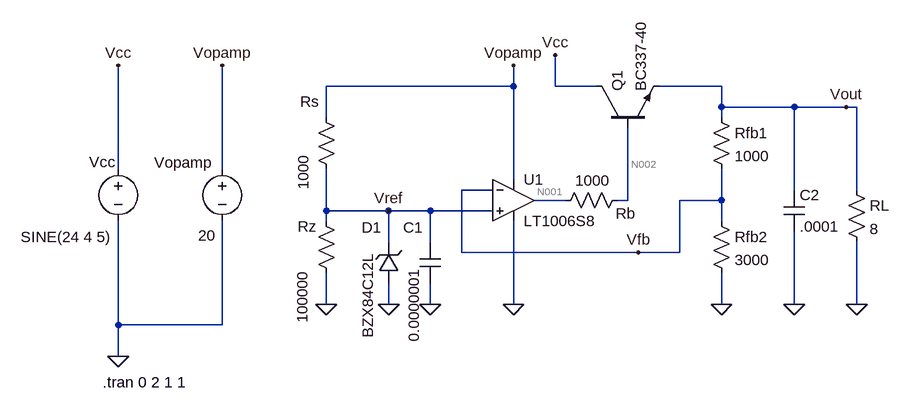
[diagram p0: schematic Op-Amp_linear_voltage_regulator (1).asc]
Op-Amp_linear_voltage_regulator (1).asc, the LTspice schematic file:
Version 4
SHEET 1 880 680
WIRE 224 -32 224 -64
WIRE 224 -32 -64 -32
WIRE 288 -32 288 -80
WIRE 352 -32 288 -32
WIRE 544 -32 448 -32
WIRE 544 0 544 -32
WIRE 656 0 544 0
WIRE 736 0 656 0
WIRE 752 0 736 0
WIRE -64 16 -64 -32
WIRE 544 16 544 0
WIRE -384 96 -384 -64
WIRE -224 96 -224 -64
WIRE 224 112 224 -32
WIRE 192 128 144 128
WIRE 656 128 656 0
WIRE 752 128 752 0
WIRE 304 144 256 144
WIRE 400 144 400 32
WIRE 400 144 384 144
WIRE 544 144 544 96
WIRE 544 144 480 144
WIRE -64 160 -64 96
WIRE 32 160 -64 160
WIRE 96 160 32 160
WIRE 192 160 96 160
WIRE -64 176 -64 160
WIRE 544 176 544 144
WIRE 32 208 32 160
WIRE 96 208 96 160
WIRE 144 224 144 128
WIRE 416 224 144 224
WIRE 480 224 480 144
WIRE 480 224 416 224
WIRE -64 304 -64 256
WIRE 32 304 32 272
WIRE 96 304 96 272
WIRE 224 304 224 176
WIRE 544 304 544 256
WIRE 656 304 656 192
WIRE 752 304 752 208
WIRE -384 336 -384 176
WIRE -224 336 -224 176
WIRE -224 336 -384 336
WIRE -384 384 -384 336
FLAG 288 -80 Vcc
FLAG 224 304 0
FLAG 32 304 0
FLAG 752 304 0
FLAG 544 304 0
FLAG -64 304 0
FLAG 736 0 Vout
FLAG 32 160 Vref
FLAG 96 304 0
FLAG 416 224 Vfb
FLAG -384 -64 Vcc
FLAG -384 384 0
FLAG -224 -64 Vopamp
FLAG 224 -64 Vopamp
FLAG 656 304 0
SYMBOL zener 48 272 R180
WINDOW 0 27 86 Left 2
WINDOW 3 48 47 VLeft 2
SYMATTR InstName D1
SYMATTR Value BZX84C12L
SYMBOL res -80 0 R0
WINDOW 0 -24 -8 Left 2
WINDOW 3 -19 127 VLeft 2
SYMATTR InstName Rs
SYMATTR Value 1000
SYMBOL res 528 160 R0
SYMATTR InstName Rfb2
SYMATTR Value 3000
SYMBOL res 528 0 R0
SYMATTR InstName Rfb1
SYMATTR Value 1000
SYMBOL res 736 112 R0
SYMATTR InstName RL
SYMATTR Value 8
SYMBOL res 400 128 R90
WINDOW 0 52 3 VBottom 2
WINDOW 3 -30 54 VTop 2
SYMATTR InstName Rb
SYMATTR Value 1000
SYMBOL res -80 160 R0
WINDOW 0 -28 24 Left 2
WINDOW 3 -21 173 VLeft 2
SYMATTR InstName Rz
SYMATTR Value 100000
SYMBOL cap 80 208 R0
WINDOW 0 -26 -22 Left 2
WINDOW 3 -9 154 VLeft 2
SYMATTR InstName C1
SYMATTR Value 0.0000001
SYMBOL voltage -384 80 R0
WINDOW 0 -45 5 Left 2
WINDOW 3 -150 120 Left 2
WINDOW 123 0 0 Left 2
WINDOW 39 0 0 Left 2
SYMATTR InstName Vcc
SYMATTR Value SINE(24 4 5)
SYMBOL Opamps\\LT1006S8 224 80 R0
SYMATTR InstName U1
SYMBOL voltage -224 80 R0
WINDOW 0 -105 6 Left 2
WINDOW 3 -37 118 Left 2
WINDOW 123 0 0 Left 2
WINDOW 39 0 0 Left 2
SYMATTR InstName Vopamp
SYMATTR Value 20
SYMBOL cap 640 128 R0
SYMATTR InstName C2
SYMATTR Value .0001
SYMBOL npn 352 32 R270
SYMATTR InstName Q1
SYMATTR Value BC337-40
TEXT -408 424 Left 2 !.tran 0 2 1 1

The netlist it stands for:
* Op-Amp_linear_voltage_regulator (1).asc
D1 0 Vref BZX84C12L
Rs Vopamp Vref 1000
Rfb2 Vfb 0 3000
Rfb1 Vout Vfb 1000
RL Vout 0 8
Rb N002 N001 1000
Rz Vref 0 100000
C1 Vref 0 0.0000001
Vcc Vcc 0 SINE(24 4 5)
XU1 Vref Vfb Vopamp 0 N001 LT1006S8  ; pins In+ In- V+ V- OUT
Vopamp Vopamp 0 20
C2 Vout 0 .0001
Q1 Vcc N002 Vout 0 BC337-40
.model D D
.lib standard.dio
.model NPN NPN
.model PNP PNP
.lib standard.bjt
.tran 0 2 1 1
.backanno
.end

* Results of the author's LTspice run, read from the files saved beside the schematic
* Operating Point, zero values left out:
*   V(vref) = 12.27 V
*   V(vopamp) = 20 V
*   V(vfb) = 7.966 V
*   V(vout) = 10.62 V
*   V(n002) = 11.7 V
*   V(n001) = 19.03 V
*   V(vcc) = 24 V
*   Ic(Q1) = 1.323 A
*   Ib(Q1) = 7.332 mA
*   Ie(Q1) = -1.33 A
*   I(D1) = -7.611 mA
*   I(Rz) = 122.7 µA
*   I(Rb) = -7.332 mA
*   I(Rl) = 1.328 A
*   I(Rfb1) = 2.655 mA
*   I(Rfb2) = 2.655 mA
*   I(Rs) = 7.734 mA
*   I(Vopamp) = -15.05 mA
*   I(Vcc) = -1.323 A
*   Ix(u1:1) = 1.731 nA
*   Ix(u1:2) = -19.33 nA
*   Ix(u1:3) = 7.318 mA
*   Ix(u1:4) = -1.42 nA
*   Ix(u1:5) = -7.332 mA
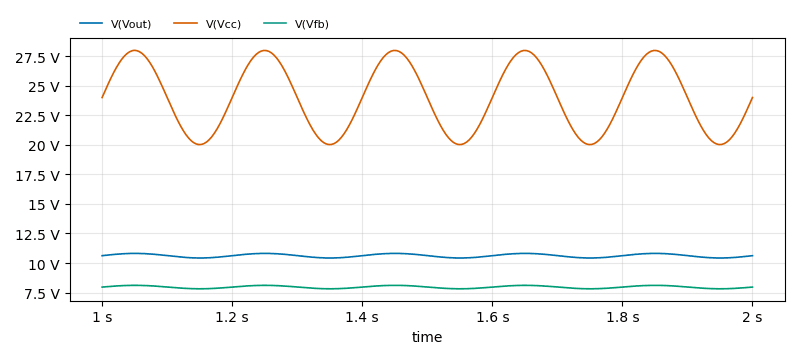
[diagram p1: Transient Analysis of Op-Amp_linear_voltage_regulator (1).asc, plotted from the saved traces]
* Transient Analysis, 1 run:
*   V(Vout): min 10.42 V, max 10.81 V, average 10.62 V, rms 10.62 V, last 10.62 V
*   V(Vcc): min 20.02 V, max 27.99 V, average 24 V, rms 24.16 V, last 24 V
*   V(Vfb): min 7.818 V, max 8.11 V, average 7.965 V, rms 7.965 V, last 7.964 V